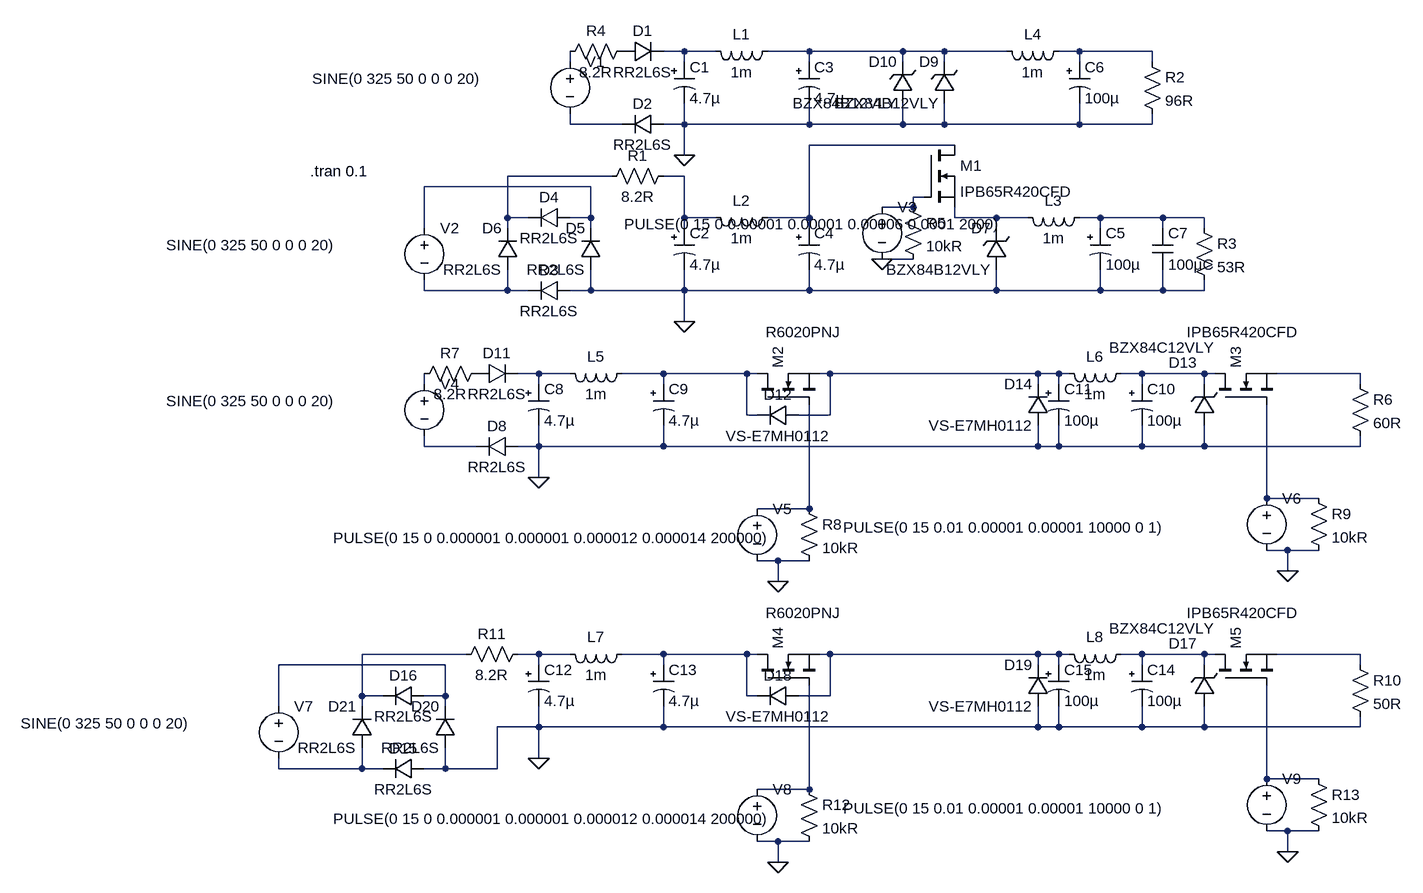
[diagram p0: schematic Step_Down_AC_W_Mosfet_LNK306_Emul.asc]
Step_Down_AC_W_Mosfet_LNK306_Emul.asc, the LTspice schematic file:
Version 4
SHEET 1 1268 1348
WIRE 144 80 112 80
WIRE 192 80 144 80
WIRE 336 80 272 80
WIRE 480 80 336 80
WIRE 544 80 480 80
WIRE 640 80 544 80
WIRE 752 80 720 80
WIRE 864 80 752 80
WIRE -32 96 -32 80
WIRE 144 96 144 80
WIRE 336 96 336 80
WIRE 480 96 480 80
WIRE 544 96 544 80
WIRE 752 96 752 80
WIRE 864 96 864 80
WIRE -32 192 -32 176
WIRE 48 192 -32 192
WIRE 144 192 144 160
WIRE 144 192 112 192
WIRE 336 192 336 160
WIRE 336 192 144 192
WIRE 480 192 480 160
WIRE 480 192 336 192
WIRE 544 192 544 160
WIRE 544 192 480 192
WIRE 752 192 752 160
WIRE 752 192 544 192
WIRE 864 192 864 176
WIRE 864 192 752 192
WIRE 560 224 336 224
WIRE 144 240 144 192
WIRE 32 272 -128 272
WIRE 144 272 112 272
WIRE 0 288 -256 288
WIRE 512 304 496 304
WIRE 496 320 496 304
WIRE 496 320 448 320
WIRE -128 336 -128 272
WIRE -96 336 -128 336
WIRE 0 336 0 288
WIRE 0 336 -32 336
WIRE 144 336 144 272
WIRE 192 336 144 336
WIRE 336 336 336 224
WIRE 336 336 272 336
WIRE 560 336 560 320
WIRE 624 336 560 336
WIRE 672 336 624 336
WIRE 784 336 752 336
WIRE 880 336 784 336
WIRE 944 336 880 336
WIRE -256 352 -256 288
WIRE -128 352 -128 336
WIRE 0 352 0 336
WIRE 144 352 144 336
WIRE 336 352 336 336
WIRE 624 352 624 336
WIRE 784 352 784 336
WIRE 880 352 880 336
WIRE 944 352 944 336
WIRE 496 400 448 400
WIRE -256 448 -256 432
WIRE -128 448 -128 416
WIRE -128 448 -256 448
WIRE -96 448 -128 448
WIRE 0 448 0 416
WIRE 0 448 -32 448
WIRE 144 448 144 416
WIRE 144 448 0 448
WIRE 336 448 336 416
WIRE 336 448 144 448
WIRE 624 448 624 416
WIRE 624 448 336 448
WIRE 784 448 784 416
WIRE 784 448 624 448
WIRE 880 448 880 416
WIRE 880 448 784 448
WIRE 944 448 944 432
WIRE 944 448 880 448
WIRE 144 496 144 448
WIRE -80 576 -112 576
WIRE -32 576 -80 576
WIRE 112 576 48 576
WIRE 240 576 112 576
WIRE 256 576 240 576
WIRE 368 576 352 576
WIRE 688 576 368 576
WIRE 720 576 688 576
WIRE 736 576 720 576
WIRE 848 576 816 576
WIRE 944 576 848 576
WIRE 960 576 944 576
WIRE 1184 576 1056 576
WIRE -256 592 -256 576
WIRE -80 592 -80 576
WIRE 112 592 112 576
WIRE 688 592 688 576
WIRE 720 592 720 576
WIRE 848 592 848 576
WIRE 944 592 944 576
WIRE 1184 592 1184 576
WIRE 240 640 240 576
WIRE 256 640 240 640
WIRE 368 640 368 576
WIRE 368 640 320 640
WIRE -256 688 -256 672
WIRE -176 688 -256 688
WIRE -80 688 -80 656
WIRE -80 688 -112 688
WIRE 112 688 112 656
WIRE 112 688 -80 688
WIRE 688 688 688 656
WIRE 688 688 112 688
WIRE 720 688 720 656
WIRE 720 688 688 688
WIRE 848 688 848 656
WIRE 848 688 720 688
WIRE 944 688 944 656
WIRE 944 688 848 688
WIRE 1184 688 1184 672
WIRE 1184 688 944 688
WIRE -80 736 -80 688
WIRE 1040 768 1040 624
WIRE 1120 768 1040 768
WIRE 336 784 336 624
WIRE 336 784 256 784
WIRE 1072 848 1040 848
WIRE 1120 848 1072 848
WIRE 288 864 256 864
WIRE 336 864 288 864
WIRE 1072 880 1072 848
WIRE 288 896 288 864
WIRE -192 1008 -352 1008
WIRE -80 1008 -112 1008
WIRE -32 1008 -80 1008
WIRE 112 1008 48 1008
WIRE 240 1008 112 1008
WIRE 256 1008 240 1008
WIRE 368 1008 352 1008
WIRE 688 1008 368 1008
WIRE 720 1008 688 1008
WIRE 736 1008 720 1008
WIRE 848 1008 816 1008
WIRE 944 1008 848 1008
WIRE 960 1008 944 1008
WIRE 1184 1008 1056 1008
WIRE -224 1024 -480 1024
WIRE -80 1024 -80 1008
WIRE 112 1024 112 1008
WIRE 688 1024 688 1008
WIRE 720 1024 720 1008
WIRE 848 1024 848 1008
WIRE 944 1024 944 1008
WIRE 1184 1024 1184 1008
WIRE -352 1072 -352 1008
WIRE -320 1072 -352 1072
WIRE -224 1072 -224 1024
WIRE -224 1072 -256 1072
WIRE 240 1072 240 1008
WIRE 256 1072 240 1072
WIRE 368 1072 368 1008
WIRE 368 1072 320 1072
WIRE -480 1088 -480 1024
WIRE -352 1088 -352 1072
WIRE -224 1088 -224 1072
WIRE -80 1120 -80 1088
WIRE -80 1120 -144 1120
WIRE 112 1120 112 1088
WIRE 112 1120 -80 1120
WIRE 688 1120 688 1088
WIRE 688 1120 112 1120
WIRE 720 1120 720 1088
WIRE 720 1120 688 1120
WIRE 848 1120 848 1088
WIRE 848 1120 720 1120
WIRE 944 1120 944 1088
WIRE 944 1120 848 1120
WIRE 1184 1120 1184 1104
WIRE 1184 1120 944 1120
WIRE -80 1168 -80 1120
WIRE -480 1184 -480 1168
WIRE -352 1184 -352 1152
WIRE -352 1184 -480 1184
WIRE -320 1184 -352 1184
WIRE -224 1184 -224 1152
WIRE -224 1184 -256 1184
WIRE -144 1184 -144 1120
WIRE -144 1184 -224 1184
WIRE 1040 1200 1040 1056
WIRE 1120 1200 1040 1200
WIRE 336 1216 336 1056
WIRE 336 1216 256 1216
WIRE 1072 1280 1040 1280
WIRE 1120 1280 1072 1280
WIRE 288 1296 256 1296
WIRE 336 1296 288 1296
WIRE 1072 1312 1072 1280
WIRE 288 1328 288 1296
FLAG 144 240 0
FLAG 144 496 0
FLAG 448 400 0
FLAG -80 736 0
FLAG 288 896 0
FLAG 1072 880 0
FLAG -80 1168 0
FLAG 288 1328 0
FLAG 1072 1312 0
SYMBOL diode 112 176 R90
WINDOW 0 0 32 VBottom 2
WINDOW 3 32 32 VTop 2
SYMATTR InstName D2
SYMATTR Value RR2L6S
SYMBOL ind 288 64 R90
WINDOW 0 5 56 VBottom 2
WINDOW 3 32 56 VTop 2
SYMATTR InstName L1
SYMATTR Value 1m
SYMATTR SpiceLine Ipk=1 Rser=1.6 Rpar=94858.5 Cpar=0 mfg="Bourns, Inc." pn="SDR1307-102KL"
SYMBOL polcap 128 96 R0
WINDOW 3 24 56 Left 2
SYMATTR Value 4.7µ
SYMATTR InstName C1
SYMATTR Description Capacitor
SYMATTR Type cap
SYMATTR SpiceLine V=450 Irms=50m Rser=0.8763 Lser=5.54n
SYMBOL voltage -32 80 R0
WINDOW 3 -397 42 Left 2
WINDOW 123 0 0 Left 0
WINDOW 39 0 0 Left 0
SYMATTR Value SINE(0 325 50 0 0 0 20)
SYMATTR InstName V1
SYMBOL diode 48 96 R270
WINDOW 0 32 32 VTop 2
WINDOW 3 0 32 VBottom 2
SYMATTR InstName D1
SYMATTR Value RR2L6S
SYMBOL polcap 320 96 R0
WINDOW 3 24 56 Left 2
SYMATTR Value 4.7µ
SYMATTR InstName C3
SYMATTR Description Capacitor
SYMATTR Type cap
SYMATTR SpiceLine V=450 Irms=50m Rser=0.8763 Lser=5.54n
SYMBOL diode -32 432 R90
WINDOW 0 0 32 VBottom 2
WINDOW 3 32 32 VTop 2
SYMATTR InstName D3
SYMATTR Value RR2L6S
SYMBOL ind 288 320 R90
WINDOW 0 5 56 VBottom 2
WINDOW 3 32 56 VTop 2
SYMATTR InstName L2
SYMATTR Value 1m
SYMATTR SpiceLine Ipk=1 Rser=1.6 Rpar=94858.5 Cpar=0 mfg="Bourns, Inc." pn="SDR1307-102KL"
SYMBOL polcap 128 352 R0
WINDOW 3 24 56 Left 2
SYMATTR Value 4.7µ
SYMATTR InstName C2
SYMATTR Description Capacitor
SYMATTR Type cap
SYMATTR SpiceLine V=450 Irms=50m Rser=0.8763 Lser=5.54n
SYMBOL voltage -256 336 R0
WINDOW 3 -397 42 Left 2
WINDOW 123 0 0 Left 0
WINDOW 39 0 0 Left 0
SYMATTR Value SINE(0 325 50 0 0 0 20)
SYMATTR InstName V2
SYMBOL diode -32 320 R90
WINDOW 0 0 32 VBottom 2
WINDOW 3 32 32 VTop 2
SYMATTR InstName D4
SYMATTR Value RR2L6S
SYMBOL polcap 320 352 R0
WINDOW 3 24 56 Left 2
SYMATTR Value 4.7µ
SYMATTR InstName C4
SYMATTR Description Capacitor
SYMATTR Type cap
SYMATTR SpiceLine V=450 Irms=50m Rser=0.8763 Lser=5.54n
SYMBOL diode 16 416 R180
WINDOW 0 24 64 Left 2
WINDOW 3 24 0 Left 2
SYMATTR InstName D5
SYMATTR Value RR2L6S
SYMBOL diode -112 416 R180
WINDOW 0 24 64 Left 2
WINDOW 3 24 0 Left 2
SYMATTR InstName D6
SYMATTR Value RR2L6S
SYMBOL zener 560 160 R180
WINDOW 0 24 64 Left 2
WINDOW 3 24 0 Left 2
SYMATTR InstName D9
SYMATTR Value BZX84B12VLY
SYMBOL zener 496 160 R180
WINDOW 0 24 64 Left 2
WINDOW 3 24 0 Left 2
SYMATTR InstName D10
SYMATTR Value BZX84B12VLY
SYMBOL ind 768 320 R90
WINDOW 0 5 56 VBottom 2
WINDOW 3 32 56 VTop 2
SYMATTR InstName L3
SYMATTR Value 1m
SYMATTR SpiceLine Ipk=1 Rser=1.6 Rpar=94858.5 Cpar=0 mfg="Bourns, Inc." pn="SDR1307-102KL"
SYMBOL polcap 768 352 R0
WINDOW 3 24 56 Left 2
SYMATTR Value 100µ
SYMATTR InstName C5
SYMATTR Description Capacitor
SYMATTR Type cap
SYMATTR SpiceLine V=63 Irms=420m Rser=0.2214 Lser=6.56n mfg="Würth Elektronik" pn="865060757007 WCAP-ASLL 10x10,5" type="Al electrolytic"
SYMBOL res 928 336 R0
SYMATTR InstName R3
SYMATTR Value 53R
SYMBOL ind 736 64 R90
WINDOW 0 5 56 VBottom 2
WINDOW 3 32 56 VTop 2
SYMATTR InstName L4
SYMATTR Value 1m
SYMATTR SpiceLine Ipk=1 Rser=1.6 Rpar=94858.5 Cpar=0 mfg="Bourns, Inc." pn="SDR1307-102KL"
SYMBOL polcap 736 96 R0
WINDOW 3 24 56 Left 2
SYMATTR Value 100µ
SYMATTR InstName C6
SYMATTR Description Capacitor
SYMATTR Type cap
SYMATTR SpiceLine V=63 Irms=420m Rser=0.2214 Lser=6.56n mfg="Würth Elektronik" pn="865060757007 WCAP-ASLL 10x10,5" type="Al electrolytic"
SYMBOL res 848 80 R0
SYMATTR InstName R2
SYMATTR Value 96R
SYMBOL res 128 256 R90
WINDOW 0 0 56 VBottom 2
WINDOW 3 32 56 VTop 2
SYMATTR InstName R1
SYMATTR Value 8.2R
SYMBOL res 64 64 R90
WINDOW 0 0 56 VBottom 2
WINDOW 3 32 56 VTop 2
SYMATTR InstName R4
SYMATTR Value 8.2R
SYMBOL cap 864 352 R0
SYMATTR InstName C7
SYMATTR Value 100µC
SYMBOL nmos 512 224 R0
SYMATTR InstName M1
SYMATTR Value IPB65R420CFD
SYMBOL voltage 448 304 R0
WINDOW 3 -397 42 Left 2
WINDOW 123 0 0 Left 0
WINDOW 39 0 0 Left 0
SYMATTR Value PULSE(0 15 0 0.00001 0.00001 0.00006 0.0001 2000)
SYMATTR InstName V3
SYMBOL res 480 304 R0
SYMATTR InstName R5
SYMATTR Value 10kR
SYMBOL zener 640 416 R180
WINDOW 0 24 64 Left 2
WINDOW 3 24 0 Left 2
SYMATTR InstName D7
SYMATTR Value BZX84B12VLY
SYMBOL diode -112 672 R90
WINDOW 0 0 32 VBottom 2
WINDOW 3 32 32 VTop 2
SYMATTR InstName D8
SYMATTR Value RR2L6S
SYMBOL ind 64 560 R90
WINDOW 0 5 56 VBottom 2
WINDOW 3 32 56 VTop 2
SYMATTR InstName L5
SYMATTR Value 1m
SYMATTR SpiceLine Ipk=1 Rser=1.6 Rpar=94858.5 Cpar=0 mfg="Bourns, Inc." pn="SDR1307-102KL"
SYMBOL polcap -96 592 R0
WINDOW 3 24 56 Left 2
SYMATTR Value 4.7µ
SYMATTR InstName C8
SYMATTR Description Capacitor
SYMATTR Type cap
SYMATTR SpiceLine V=450 Irms=50m Rser=0.8763 Lser=5.54n
SYMBOL diode -176 592 R270
WINDOW 0 32 32 VTop 2
WINDOW 3 0 32 VBottom 2
SYMATTR InstName D11
SYMATTR Value RR2L6S
SYMBOL polcap 96 592 R0
WINDOW 3 24 56 Left 2
SYMATTR Value 4.7µ
SYMATTR InstName C9
SYMATTR Description Capacitor
SYMATTR Type cap
SYMATTR SpiceLine V=450 Irms=50m Rser=0.8763 Lser=5.54n
SYMBOL zener 960 656 R180
WINDOW 0 27 97 Left 2
WINDOW 3 0 120 Left 2
SYMATTR InstName D13
SYMATTR Value BZX84C12VLY
SYMBOL ind 832 560 R90
WINDOW 0 5 56 VBottom 2
WINDOW 3 32 56 VTop 2
SYMATTR InstName L6
SYMATTR Value 1m
SYMATTR SpiceLine Ipk=1 Rser=1.6 Rpar=94858.5 Cpar=0
SYMBOL polcap 832 592 R0
WINDOW 3 24 56 Left 2
SYMATTR Value 100µ
SYMATTR InstName C10
SYMATTR Description Capacitor
SYMATTR Type cap
SYMATTR SpiceLine V=63 Irms=420m Rser=0.2214 Lser=6.56n
SYMBOL res 1168 576 R0
SYMATTR InstName R6
SYMATTR Value 60R
SYMBOL res -160 560 R90
WINDOW 0 0 56 VBottom 2
WINDOW 3 32 56 VTop 2
SYMATTR InstName R7
SYMATTR Value 8.2R
SYMBOL voltage -256 576 R0
WINDOW 3 -397 42 Left 2
WINDOW 123 0 0 Left 0
WINDOW 39 0 0 Left 0
SYMATTR Value SINE(0 325 50 0 0 0 20)
SYMATTR InstName V4
SYMBOL nmos 256 624 R270
WINDOW 3 112 129 VLeft 2
SYMATTR Value R6020PNJ
SYMATTR InstName M2
SYMBOL voltage 256 768 R0
WINDOW 3 -652 61 Left 2
WINDOW 123 0 0 Left 0
WINDOW 39 0 0 Left 0
SYMATTR Value PULSE(0 15 0 0.000001 0.000001 0.000012 0.000014 200000)
SYMATTR InstName V5
SYMBOL res 320 768 R0
SYMATTR InstName R8
SYMATTR Value 10kR
SYMBOL voltage 1040 752 R0
WINDOW 3 -652 61 Left 2
WINDOW 123 0 0 Left 0
WINDOW 39 0 0 Left 0
SYMATTR Value PULSE(0 15 0.01 0.00001 0.00001 10000 0 1)
SYMATTR InstName V6
SYMBOL res 1104 752 R0
SYMATTR InstName R9
SYMATTR Value 10kR
SYMBOL nmos 960 624 R270
WINDOW 3 112 129 VLeft 2
SYMATTR Value IPB65R420CFD
SYMATTR InstName M3
SYMBOL diode 320 624 R90
WINDOW 0 0 32 VBottom 2
WINDOW 3 32 32 VTop 2
SYMATTR InstName D12
SYMATTR Value VS-E7MH0112
SYMBOL diode 704 656 R180
WINDOW 0 24 64 Left 2
WINDOW 3 24 0 Left 2
SYMATTR InstName D14
SYMATTR Value VS-E7MH0112
SYMBOL polcap 704 592 R0
WINDOW 3 24 56 Left 2
SYMATTR Value 100µ
SYMATTR InstName C11
SYMATTR Description Capacitor
SYMATTR Type cap
SYMATTR SpiceLine V=63 Irms=420m Rser=0.2214 Lser=6.56n
SYMBOL ind 64 992 R90
WINDOW 0 5 56 VBottom 2
WINDOW 3 32 56 VTop 2
SYMATTR InstName L7
SYMATTR Value 1m
SYMATTR SpiceLine Ipk=1 Rser=1.6 Rpar=94858.5 Cpar=0 mfg="Bourns, Inc." pn="SDR1307-102KL"
SYMBOL polcap -96 1024 R0
WINDOW 3 24 56 Left 2
SYMATTR Value 4.7µ
SYMATTR InstName C12
SYMATTR Description Capacitor
SYMATTR Type cap
SYMATTR SpiceLine V=450 Irms=50m Rser=0.8763 Lser=5.54n
SYMBOL polcap 96 1024 R0
WINDOW 3 24 56 Left 2
SYMATTR Value 4.7µ
SYMATTR InstName C13
SYMATTR Description Capacitor
SYMATTR Type cap
SYMATTR SpiceLine V=450 Irms=50m Rser=0.8763 Lser=5.54n
SYMBOL zener 960 1088 R180
WINDOW 0 27 97 Left 2
WINDOW 3 0 120 Left 2
SYMATTR InstName D17
SYMATTR Value BZX84C12VLY
SYMBOL ind 832 992 R90
WINDOW 0 5 56 VBottom 2
WINDOW 3 32 56 VTop 2
SYMATTR InstName L8
SYMATTR Value 1m
SYMATTR SpiceLine Ipk=1 Rser=1.6 Rpar=94858.5 Cpar=0
SYMBOL polcap 832 1024 R0
WINDOW 3 24 56 Left 2
SYMATTR Value 100µ
SYMATTR InstName C14
SYMATTR Description Capacitor
SYMATTR Type cap
SYMATTR SpiceLine V=63 Irms=420m Rser=0.2214 Lser=6.56n
SYMBOL res 1168 1008 R0
SYMATTR InstName R10
SYMATTR Value 50R
SYMBOL nmos 256 1056 R270
WINDOW 3 112 129 VLeft 2
SYMATTR Value R6020PNJ
SYMATTR InstName M4
SYMBOL voltage 256 1200 R0
WINDOW 3 -652 61 Left 2
WINDOW 123 0 0 Left 0
WINDOW 39 0 0 Left 0
SYMATTR Value PULSE(0 15 0 0.000001 0.000001 0.000012 0.000014 200000)
SYMATTR InstName V8
SYMBOL res 320 1200 R0
SYMATTR InstName R12
SYMATTR Value 10kR
SYMBOL voltage 1040 1184 R0
WINDOW 3 -652 61 Left 2
WINDOW 123 0 0 Left 0
WINDOW 39 0 0 Left 0
SYMATTR Value PULSE(0 15 0.01 0.00001 0.00001 10000 0 1)
SYMATTR InstName V9
SYMBOL res 1104 1184 R0
SYMATTR InstName R13
SYMATTR Value 10kR
SYMBOL nmos 960 1056 R270
WINDOW 3 112 129 VLeft 2
SYMATTR Value IPB65R420CFD
SYMATTR InstName M5
SYMBOL diode 320 1056 R90
WINDOW 0 0 32 VBottom 2
WINDOW 3 32 32 VTop 2
SYMATTR InstName D18
SYMATTR Value VS-E7MH0112
SYMBOL diode 704 1088 R180
WINDOW 0 24 64 Left 2
WINDOW 3 24 0 Left 2
SYMATTR InstName D19
SYMATTR Value VS-E7MH0112
SYMBOL polcap 704 1024 R0
WINDOW 3 24 56 Left 2
SYMATTR Value 100µ
SYMATTR InstName C15
SYMATTR Description Capacitor
SYMATTR Type cap
SYMATTR SpiceLine V=63 Irms=420m Rser=0.2214 Lser=6.56n
SYMBOL diode -256 1168 R90
WINDOW 0 0 32 VBottom 2
WINDOW 3 32 32 VTop 2
SYMATTR InstName D15
SYMATTR Value RR2L6S
SYMBOL voltage -480 1072 R0
WINDOW 3 -397 42 Left 2
WINDOW 123 0 0 Left 0
WINDOW 39 0 0 Left 0
SYMATTR Value SINE(0 325 50 0 0 0 20)
SYMATTR InstName V7
SYMBOL diode -256 1056 R90
WINDOW 0 0 32 VBottom 2
WINDOW 3 32 32 VTop 2
SYMATTR InstName D16
SYMATTR Value RR2L6S
SYMBOL diode -208 1152 R180
WINDOW 0 24 64 Left 2
WINDOW 3 24 0 Left 2
SYMATTR InstName D20
SYMATTR Value RR2L6S
SYMBOL diode -336 1152 R180
WINDOW 0 24 64 Left 2
WINDOW 3 24 0 Left 2
SYMATTR InstName D21
SYMATTR Value RR2L6S
SYMBOL res -96 992 R90
WINDOW 0 0 56 VBottom 2
WINDOW 3 32 56 VTop 2
SYMATTR InstName R11
SYMATTR Value 8.2R
TEXT -432 264 Left 2 !.tran 0.1

The netlist it stands for:
* Step_Down_AC_W_Mosfet_LNK306_Emul.asc
D2 0 N005 RR2L6S
L1 N002 N001 1m Ipk=1 Rser=1.6 Rpar=94858.5 Cpar=0 mfg="Bourns, Inc." pn="SDR1307-102KL"
C1 N001 0 4.7µ V=450 Irms=50m Rser=0.8763 Lser=5.54n
V1 N004 N005 SINE(0 325 50 0 0 0 20)
D1 P001 N001 RR2L6S
C3 N002 0 4.7µ V=450 Irms=50m Rser=0.8763 Lser=5.54n
D3 0 N013 RR2L6S
L2 N006 N008 1m Ipk=1 Rser=1.6 Rpar=94858.5 Cpar=0 mfg="Bourns, Inc." pn="SDR1307-102KL"
C2 N008 0 4.7µ V=450 Irms=50m Rser=0.8763 Lser=5.54n
V2 N009 N013 SINE(0 325 50 0 0 0 20)
D4 N009 N007 RR2L6S
C4 N006 0 4.7µ V=450 Irms=50m Rser=0.8763 Lser=5.54n
D5 0 N009 RR2L6S
D6 N013 N007 RR2L6S
D9 0 N002 BZX84B12VLY
D10 0 N002 BZX84B12VLY
L3 N012 N011 1m Ipk=1 Rser=1.6 Rpar=94858.5 Cpar=0 mfg="Bourns, Inc." pn="SDR1307-102KL"
C5 N012 0 100µ V=63 Irms=420m Rser=0.2214 Lser=6.56n mfg="Würth Elektronik" pn="865060757007 WCAP-ASLL 10x10,5" type="Al electrolytic"
R3 N012 0 53R
L4 N003 N002 1m Ipk=1 Rser=1.6 Rpar=94858.5 Cpar=0 mfg="Bourns, Inc." pn="SDR1307-102KL"
C6 N003 0 100µ V=63 Irms=420m Rser=0.2214 Lser=6.56n mfg="Würth Elektronik" pn="865060757007 WCAP-ASLL 10x10,5" type="Al electrolytic"
R2 N003 0 96R
R1 N008 N007 8.2R
R4 P001 N004 8.2R
C7 N012 0 100µC
M1 N006 N010 N011 N011 IPB65R420CFD
V3 N010 0 PULSE(0 15 0 0.00001 0.00001 0.00006 0.0001 2000)
R5 N010 0 10kR
D7 0 N011 BZX84B12VLY
D8 0 N020 RR2L6S
L5 N015 N014 1m Ipk=1 Rser=1.6 Rpar=94858.5 Cpar=0 mfg="Bourns, Inc." pn="SDR1307-102KL"
C8 N014 0 4.7µ V=450 Irms=50m Rser=0.8763 Lser=5.54n
D11 P002 N014 RR2L6S
C9 N015 0 4.7µ V=450 Irms=50m Rser=0.8763 Lser=5.54n
D13 0 N017 BZX84C12VLY
L6 N017 N016 1m Ipk=1 Rser=1.6 Rpar=94858.5 Cpar=0
C10 N017 0 100µ V=63 Irms=420m Rser=0.2214 Lser=6.56n
R6 N018 0 60R
R7 P002 N019 8.2R
V4 N019 N020 SINE(0 325 50 0 0 0 20)
M2 N015 N022 N016 N016 R6020PNJ
V5 N022 0 PULSE(0 15 0 0.000001 0.000001 0.000012 0.000014 200000)
R8 N022 0 10kR
V6 N021 0 PULSE(0 15 0.01 0.00001 0.00001 10000 0 1)
R9 N021 0 10kR
M3 N017 N021 N018 N018 IPB65R420CFD
D12 N016 N015 VS-E7MH0112
D14 0 N016 VS-E7MH0112
C11 N016 0 100µ V=63 Irms=420m Rser=0.2214 Lser=6.56n
L7 N025 N024 1m Ipk=1 Rser=1.6 Rpar=94858.5 Cpar=0 mfg="Bourns, Inc." pn="SDR1307-102KL"
C12 N024 0 4.7µ V=450 Irms=50m Rser=0.8763 Lser=5.54n
C13 N025 0 4.7µ V=450 Irms=50m Rser=0.8763 Lser=5.54n
D17 0 N027 BZX84C12VLY
L8 N027 N026 1m Ipk=1 Rser=1.6 Rpar=94858.5 Cpar=0
C14 N027 0 100µ V=63 Irms=420m Rser=0.2214 Lser=6.56n
R10 N028 0 50R
M4 N025 N032 N026 N026 R6020PNJ
V8 N032 0 PULSE(0 15 0 0.000001 0.000001 0.000012 0.000014 200000)
R12 N032 0 10kR
V9 N031 0 PULSE(0 15 0.01 0.00001 0.00001 10000 0 1)
R13 N031 0 10kR
M5 N027 N031 N028 N028 IPB65R420CFD
D18 N026 N025 VS-E7MH0112
D19 0 N026 VS-E7MH0112
C15 N026 0 100µ V=63 Irms=420m Rser=0.2214 Lser=6.56n
D15 0 N030 RR2L6S
V7 N029 N030 SINE(0 325 50 0 0 0 20)
D16 N029 N023 RR2L6S
D20 0 N029 RR2L6S
D21 N030 N023 RR2L6S
R11 N024 N023 8.2R
.model D D
.lib standard.dio
.model NMOS NMOS
.model PMOS PMOS
.lib standard.mos
.tran 0.1
.backanno
.end